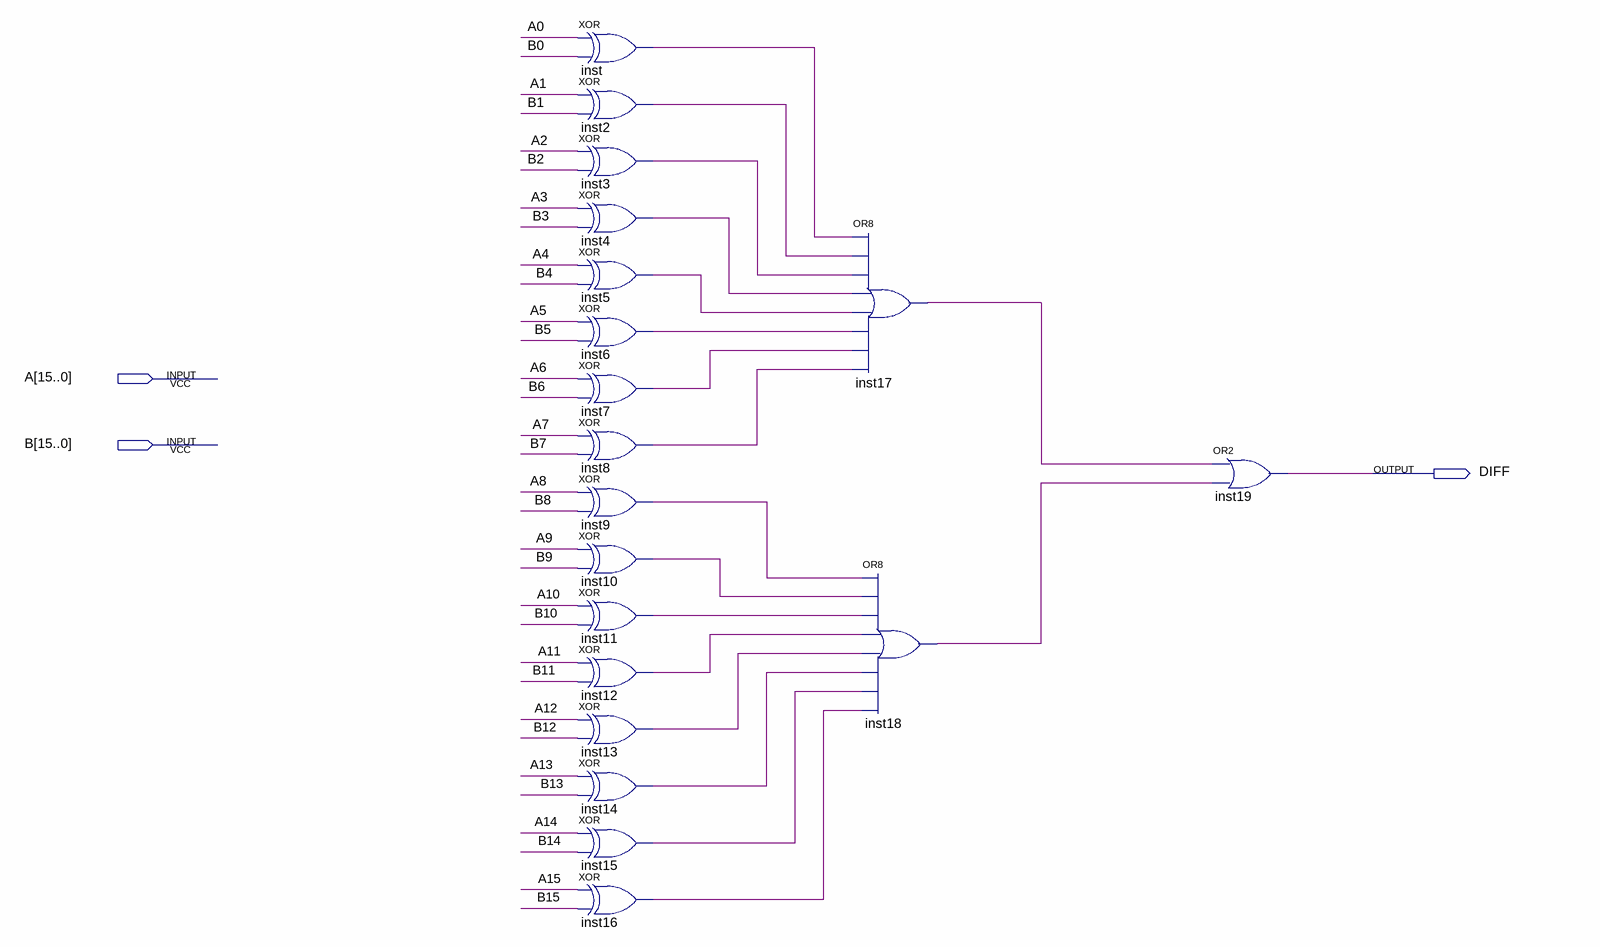
[diagram p0: schematic sheet]
// Quartus schematic DIFFR.bdf as structural Verilog: 19 symbols, 3 pins
module DIFFR (
  input  [15:0] A,
  input  [15:0] B,
  output DIFF
);

  wire inst2_out, inst3_out, inst4_out, inst5_out, inst6_out, inst7_out, inst8_out, inst9_out, inst10_out,
       inst11_out, inst12_out, inst13_out, inst14_out, inst15_out, inst16_out, inst17_out, inst18_out,
       inst_out;

  xor inst (inst_out, A[0], B[0]);
  xor inst2 (inst2_out, A[1], B[1]);
  xor inst3 (inst3_out, A[2], B[2]);
  xor inst4 (inst4_out, A[3], B[3]);
  xor inst5 (inst5_out, A[4], B[4]);
  xor inst6 (inst6_out, A[5], B[5]);
  xor inst7 (inst7_out, A[6], B[6]);
  xor inst8 (inst8_out, A[7], B[7]);
  xor inst9 (inst9_out, A[8], B[8]);
  xor inst10 (inst10_out, A[9], B[9]);
  xor inst11 (inst11_out, A[10], B[10]);
  xor inst12 (inst12_out, A[11], B[11]);
  xor inst13 (inst13_out, A[12], B[12]);
  xor inst14 (inst14_out, A[13], B[13]);
  xor inst15 (inst15_out, A[14], B[14]);
  xor inst16 (inst16_out, A[15], B[15]);
  or inst17 (inst17_out, inst_out, inst2_out, inst3_out, inst4_out, inst5_out, inst6_out, inst7_out, inst8_out);
  or inst18 (inst18_out, inst9_out, inst10_out, inst11_out, inst12_out, inst13_out, inst14_out, inst15_out, inst16_out);
  or inst19 (DIFF, inst17_out, inst18_out);
endmodule
